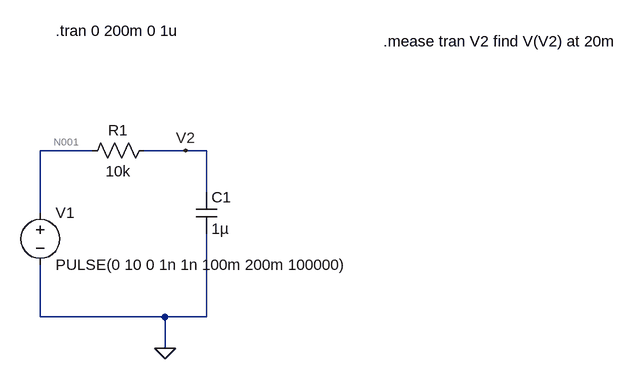
[diagram p0: schematic Draft1.asc]
Draft1.asc, the LTspice schematic file:
Version 4
SHEET 1 964 680
WIRE 128 224 48 224
WIRE 272 224 208 224
WIRE 304 224 272 224
WIRE 304 288 304 224
WIRE 48 320 48 224
WIRE 48 480 48 400
WIRE 240 480 48 480
WIRE 304 480 304 352
WIRE 304 480 240 480
WIRE 240 528 240 480
FLAG 240 528 0
FLAG 272 224 V2
SYMBOL voltage 48 304 R0
WINDOW 123 0 0 Left 0
WINDOW 39 0 0 Left 0
SYMATTR InstName V1
SYMATTR Value PULSE(0 10 0 1n 1n 100m 200m 100000)
SYMBOL res 224 208 R90
WINDOW 0 0 56 VBottom 2
WINDOW 3 32 56 VTop 2
SYMATTR InstName R1
SYMATTR Value 10k
SYMBOL cap 288 288 R0
SYMATTR InstName C1
SYMATTR Value 1µ
TEXT 72 40 Left 2 !.tran 0 200m 0 1u
TEXT 576 56 Left 2 !.mease tran V2 find V(V2) at 20m

The netlist it stands for:
* Draft1.asc
V1 N001 0 PULSE(0 10 0 1n 1n 100m 200m 100000)
R1 V2 N001 10k
C1 V2 0 1µ
.tran 0 200m 0 1u
.mease tran V2 find V(V2) at 20m
.backanno
.end

* Results of the author's LTspice run, read from the files saved beside the schematic
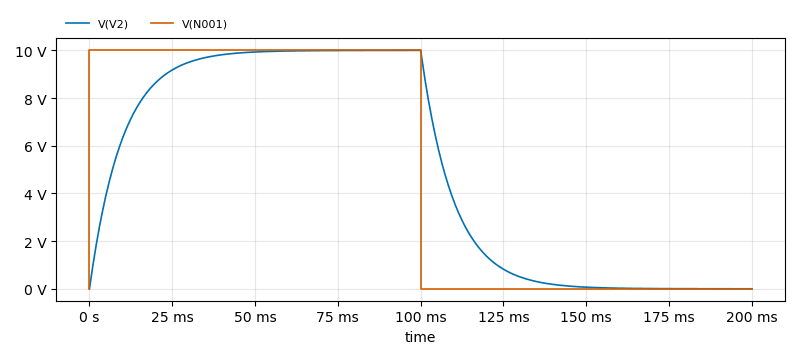
[diagram p1: Transient Analysis of Draft1.asc, plotted from the saved traces]
* Transient Analysis, 1 run:
*   V(V2): min 0 V, max 10 V, average 5 V, rms 6.709 V, last 454 µV
*   V(N001): min 0 V, max 10 V, average 5 V, rms 7.071 V, last 0 V